# Altium schematic sheet schematic.SchDoc
size A3
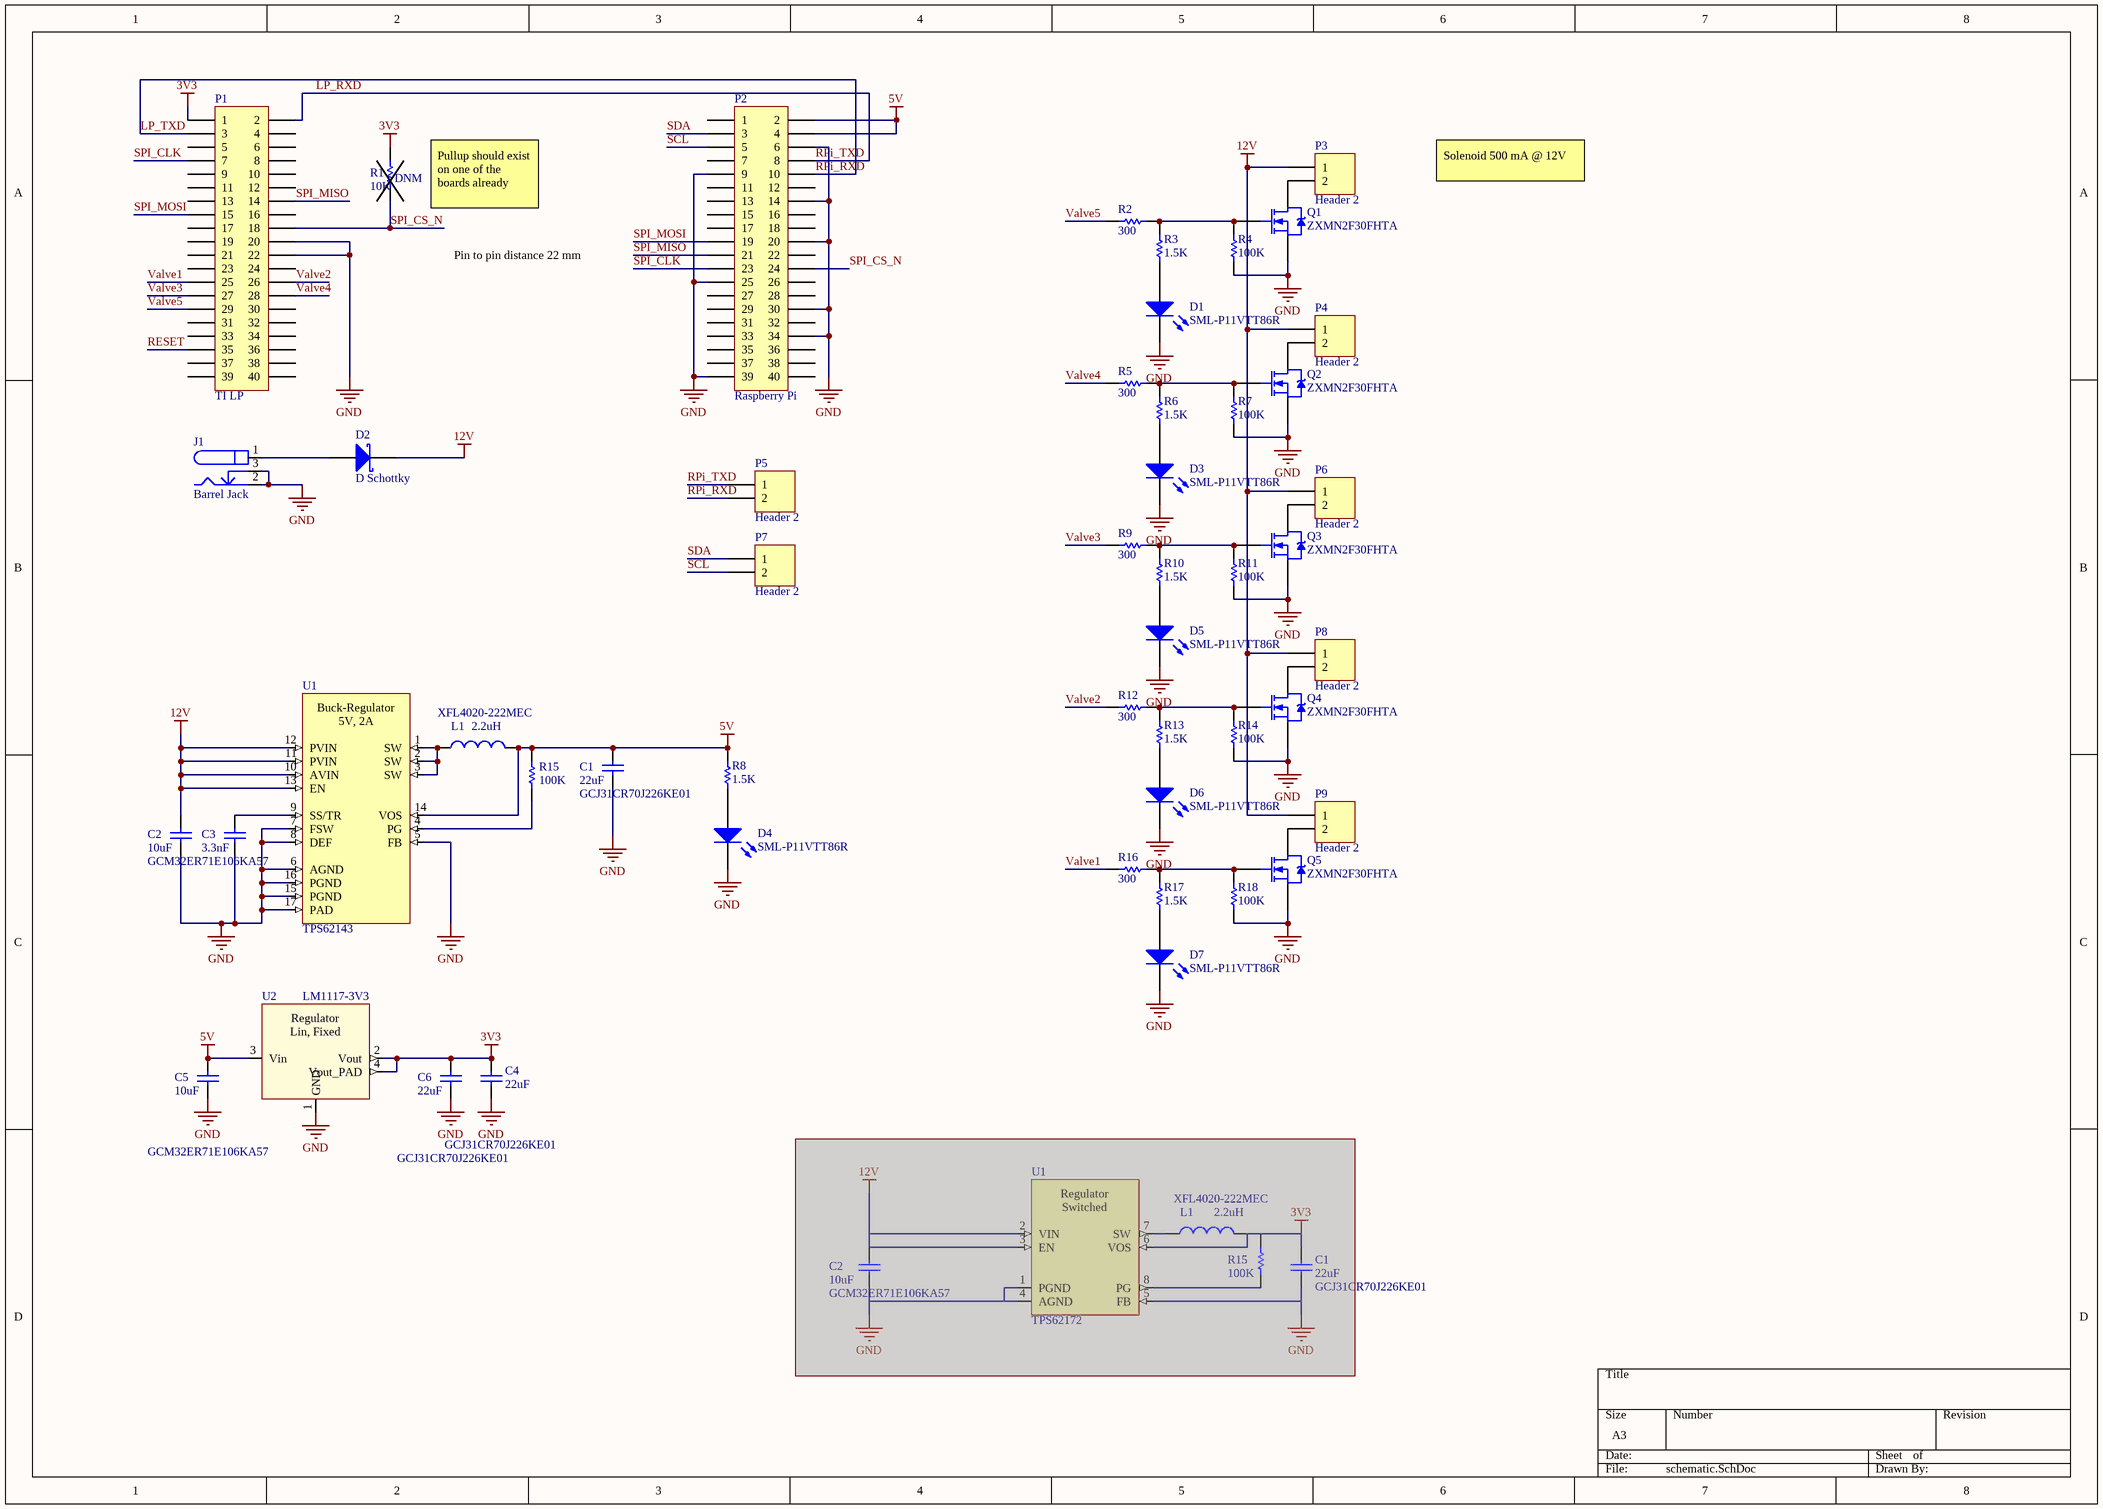
[diagram p0: schematic.SchDoc]

## Parts
(Parts that share a designator on the sheet are numbered #1, #2 ... from top to bottom, then left to right.)
C1#1  GCJ31CR70J226KE01  value 22uF  [1206 (CAP)]
C1#2  GCJ31CR70J226KE01  value 22uF  [1206 (CAP)]  (masked out: inside a compile mask, not in the netlist)
C2#1  GCM32ER71E106KA57  value 10uF  [1210 (CAP)]
C2#2  GCM32ER71E106KA57  value 10uF  [1210 (CAP)]  (masked out: inside a compile mask, not in the netlist)
C3  value 3.3nF  [0603 (CAP)]  (hidden comment: Cap)
C4  GCJ31CR70J226KE01  value 22uF  [1206 (CAP)]
C5  GCM32ER71E106KA57  value 10uF  [1210 (CAP)]
C6  GCJ31CR70J226KE01  value 22uF  [1206 (CAP)]
D1  SML-P11VTT86R  [0402 (RES)]
D2  D Schottky  [SOD123]
D3  SML-P11VTT86R  [0402 (RES)]
D4  SML-P11VTT86R  [0402 (RES)]
D5  SML-P11VTT86R  [0402 (RES)]
D6  SML-P11VTT86R  [0402 (RES)]
D7  SML-P11VTT86R  [0402 (RES)]
J1  Barrel Jack  [PRT-00119]
L1#1  XFL4020-222MEC  value 2.2uH  [XFL4020-222MEC]
L1#2  XFL4020-222MEC  value 2.2uH  [XFL4020-222MEC]  (masked out: inside a compile mask, not in the netlist)
P1  TI LP  [pinheader]
P2  Raspberry Pi  [HDR2X20]
P3  Header 2  [HDR1X2]
P4  Header 2  [HDR1X2]
P5  Header 2  [HDR1X2]
P6  Header 2  [HDR1X2]
P7  Header 2  [HDR1X2]
P8  Header 2  [HDR1X2]
P9  Header 2  [HDR1X2]
Q1  ZXMN2F30FHTA  [SOT23-NMOS]
Q2  ZXMN2F30FHTA  [SOT23-NMOS]
Q3  ZXMN2F30FHTA  [SOT23-NMOS]
Q4  ZXMN2F30FHTA  [SOT23-NMOS]
Q5  ZXMN2F30FHTA  [SOT23-NMOS]
R1  DNM  value 10K  [0402 (RES)]
R2  value 300  [0402 (RES)]  (hidden comment: Res1)
R3  value 1.5K  [0402 (RES)]  (hidden comment: Res1)
R4  value 100K  [0402 (RES)]  (hidden comment: Res1)
R5  value 300  [0402 (RES)]  (hidden comment: Res1)
R6  value 1.5K  [0402 (RES)]  (hidden comment: Res1)
R7  value 100K  [0402 (RES)]  (hidden comment: Res1)
R8  value 1.5K  [0402 (RES)]  (hidden comment: Res1)
R9  value 300  [0402 (RES)]  (hidden comment: Res1)
R10  value 1.5K  [0402 (RES)]  (hidden comment: Res1)
R11  value 100K  [0402 (RES)]  (hidden comment: Res1)
R12  value 300  [0402 (RES)]  (hidden comment: Res1)
R13  value 1.5K  [0402 (RES)]  (hidden comment: Res1)
R14  value 100K  [0402 (RES)]  (hidden comment: Res1)
R15#1  value 100K  [0402 (RES)]  (hidden comment: Res1)
R15#2  value 100K  [0402 (RES)]  (hidden comment: Res1)  (masked out: inside a compile mask, not in the netlist)
R16  value 300  [0402 (RES)]  (hidden comment: Res1)
R17  value 1.5K  [0402 (RES)]  (hidden comment: Res1)
R18  value 100K  [0402 (RES)]  (hidden comment: Res1)
U1#1  TPS62143
U1#2  TPS62172  [WSON-8]  (masked out: inside a compile mask, not in the netlist)
U2  LM1117-3V3  [SOT-223]

## Nets
3V3: C4.1 C6.1 P1.1 R1.2 U2.2(Vout) U2.4(Vout_PAD)
5V: C1#1.1 C5.1 L1#1.2 P2.2 P2.4 R8.1 R15#1.2 U1#1.14(VOS) U2.3(Vin)
12V: C2#1.1 D2.2(K) P3.1 P4.1 P6.1 P8.1 P9.1 U1#1.10(AVIN) U1#1.11(PVIN) U1#1.12(PVIN) U1#1.13(EN)
GND: C1#1.2 C2#1.2 C3.2 C4.2 C5.2 C6.2 D1.2(K) D3.2(K) D4.2(K) D5.2(K) D6.2(K) D7.2(K) J1.2(ON) J1.3(ON) P1.20 P1.22 P2.6 P2.9 P2.14 P2.20 P2.25 P2.30 P2.34 P2.39 Q1.2(S) Q2.2(S) Q3.2(S) Q4.2(S) Q5.2(S) R4.2 R7.2 R11.2 R14.2 R18.2 U1#1.5(FB) U1#1.6(AGND) U1#1.7(FSW) U1#1.8(DEF) U1#1.15(PGND) U1#1.16(PGND) U1#1.17(PAD) U2.1(GND)
LP_RXD: P1.2 P2.8 P5.1  [also labelled RPi_TXD]
LP_TXD: P1.3 P2.10 P5.2  [also labelled RPi_RXD]
RESET: P1.35
SCL: P2.5 P7.2
SDA: P2.3 P7.1
SPI_CLK: P1.7 P2.23
SPI_CS_N: P1.18 P2.24 R1.1
SPI_MISO: P1.14 P2.21
SPI_MOSI: P1.15 P2.19
Valve1: P1.25 R16.2
Valve2: P1.26 R12.2
Valve3: P1.27 R9.2
Valve4: P1.28 R5.2
Valve5: P1.29 R2.2
NetC3_1: C3.1 U1#1.9(SS/TR)
NetD1_1: D1.1(A) R3.2
NetD2_1: D2.1(A) J1.1(ON)
NetD3_1: D3.1(A) R6.2
NetD4_1: D4.1(A) R8.2
NetD5_1: D5.1(A) R10.2
NetD6_1: D6.1(A) R13.2
NetD7_1: D7.1(A) R17.2
NetL1#1_1: L1#1.1 U1#1.1(SW) U1#1.2(SW) U1#1.3(SW)
NetP3_2: P3.2 Q1.3(D)
NetP4_2: P4.2 Q2.3(D)
NetP6_2: P6.2 Q3.3(D)
NetP8_2: P8.2 Q4.3(D)
NetP9_2: P9.2 Q5.3(D)
NetQ1_1: Q1.1(G) R2.1 R3.1 R4.1
NetQ2_1: Q2.1(G) R5.1 R6.1 R7.1
NetQ3_1: Q3.1(G) R9.1 R10.1 R11.1
NetQ4_1: Q4.1(G) R12.1 R13.1 R14.1
NetQ5_1: Q5.1(G) R16.1 R17.1 R18.1
NetR15#1_1: R15#1.1 U1#1.4(PG)

Not connected (* = marked no-connect by the designer): P1 4 5 6 8 9 10 11 12 13 16 17 19 21 23 24 30 31 32 33 34 36 37 38 39 40; P2 1 7 11 12 13 15 16 17 18 22 26 27 28 29 31 32 33 35 36 37 38 40

## Notes on the sheet
- Solenoid 500 mA @ 12V
- (near R1) Pullup should exist on one of the boards already
- Pin to pin distance 22 mm
- (in symbol LM1117-FIXED) Regulator; Lin, Fixed
- (in symbol TPS62143) Buck-Regulator; 5V, 2A
- (in symbol TPS62172) Regulator; Switched

## Library data of the parts
C1#1 C1#2 C4 C6 = Cap: 1206; Published: 8-Jun-2000; LatestRevisionDate: 17-Jul-2002; LatestRevisionNote: Re-released for DXP Platform.; PackageReference: RAD-0.3; Publisher: Altium Limited; PackageDescription: Radial Cap, Thru-Hole; 2 Leads; 0.3 in Pin Spacing
  C1#1 C4 C6: Part Number: GCJ31CR70J226KE01
C2#1 C2#2 C5 = Cap: 1210; Published: 8-Jun-2000; LatestRevisionDate: 17-Jul-2002; LatestRevisionNote: Re-released for DXP Platform.; PackageReference: RAD-0.3; Publisher: Altium Limited; PackageDescription: Radial Cap, Thru-Hole; 2 Leads; 0.3 in Pin Spacing
  C2#1 C5: Part Number: GCM32ER71E106KA57
C3 = Cap: 0603; Part Number: GRM033R71E332KA12D; Published: 8-Jun-2000; LatestRevisionDate: 17-Jul-2002; LatestRevisionNote: Re-released for DXP Platform.; PackageReference: RAD-0.3; Publisher: Altium Limited; PackageDescription: Radial Cap, Thru-Hole; 2 Leads; 0.3 in Pin Spacing
D1 D3-D7 = LED2: Typical RED, GREEN, YELLOW, AMBER GaAs LED; Published: 8-Jun-2000; LatestRevisionDate: 17-Jul-2002; LatestRevisionNote: Re-released for DXP Platform.; PackageVersion: Feb-2002; PackageReference: 3.2X1.6X1.1; Publisher: Altium Limited; PackageDescription: SM LED; 2 Flat Leads; Part Number: SML-P11VTT86R
D2 = D Schottky: Schottky Diode; Part Number: B140HW-7; Published: 8-Jun-2000; LatestRevisionDate: 17-Jul-2002; LatestRevisionNote: Re-released for DXP Platform.; PackageReference: SMB; Publisher: Altium Limited; PackageDescription: DO-214-AA/SMB; 2 C-Bend Leads; Body 5.3 x 3.6 mm, inc. leads (LxW); Code_JEDEC: DO-214-AA
J1 = DC Barrel: Part Number: PRT-00119
L1#1 L1#2 = Inductor: Code_IEC: 1005; Published: 8-Jun-2000; LatestRevisionDate: 29-May-2009; LatestRevisionNote: IPC-7351 Footprint Added.; PackageReference: 0402-A; Publisher: Altium Limited; PackageDescription: Chip Inductor; Code_JEITA: 0402
  L1#1: Part Number: XFL4020-222MEC
P1 = Header 20X2: Header, 20-Pin, Dual row; Part Number: 929975-01-10-RK; LatestRevisionDate: 17-Jul-2002; LatestRevisionNote: Re-released for DXP Platform.; Publisher: Altium Limited
P2 = Header 20X2: Header, 20-Pin, Dual row; Part Number: 929975-01-20-RK; LatestRevisionDate: 17-Jul-2002; LatestRevisionNote: Re-released for DXP Platform.; Publisher: Altium Limited
P3 = Header 2: Header, 2-Pin; Part Number: 10129378-920001BLF; LatestRevisionDate: 17-Jul-2002; LatestRevisionNote: Re-released for DXP Platform.; Publisher: Altium Limited
P4-P9 = Header 2: Header, 2-Pin; LatestRevisionDate: 17-Jul-2002; LatestRevisionNote: Re-released for DXP Platform.; Publisher: Altium Limited
Q1-Q5 = NMOS-2: N-Channel Power MOSFET; Note: Pin 2 is electrically connected to pin 4.; Published: 8-Jun-2000; LatestRevisionDate: 17-Jul-2002; LatestRevisionNote: Re-released for DXP Platform.; DatasheetVersion: PD-9.814; PackageVersion: Feb-1997; PackageReference: TO-220AB; Publisher: Altium Limited; PackageDescription: TO, Thru-Hole, Vertical, Heatsink Mounted; 3 In-Line Leads; Pitch 2.54 mm; ComponentLink1Description: Manufacturer Link; ComponentLink1URL: http://www.irf.com/; Part Number: ZXMN2F30FHTA
R1 = Res1: Resistor; Part Number: AC0402FR-1310KL; Published: 8-Jun-2000; LatestRevisionDate: 17-Jul-2002; LatestRevisionNote: Re-released for DXP Platform.; PackageReference: AXIAL-0.3; Publisher: Altium Limited; PackageDescription: Axial Device, Thru-Hole; 2 Leads; 0.3 in Pin Spacing
R2 R5 R9 R12 R16 = Res1: Resistor; Part Number: ERJ-2RKF2800X; Published: 8-Jun-2000; LatestRevisionDate: 17-Jul-2002; LatestRevisionNote: Re-released for DXP Platform.; PackageReference: AXIAL-0.3; Publisher: Altium Limited; PackageDescription: Axial Device, Thru-Hole; 2 Leads; 0.3 in Pin Spacing
R3 R6 R8 R10 R13 R17 = Res1: Resistor; Part Number: RC0402FR-071K5L; Published: 8-Jun-2000; LatestRevisionDate: 17-Jul-2002; LatestRevisionNote: Re-released for DXP Platform.; PackageReference: AXIAL-0.3; Publisher: Altium Limited; PackageDescription: Axial Device, Thru-Hole; 2 Leads; 0.3 in Pin Spacing
R4 R7 R11 R14 R15#1 R18 = Res1: Resistor; Part Number: ERJ-2RKF1003X; Published: 8-Jun-2000; LatestRevisionDate: 17-Jul-2002; LatestRevisionNote: Re-released for DXP Platform.; PackageReference: AXIAL-0.3; Publisher: Altium Limited; PackageDescription: Axial Device, Thru-Hole; 2 Leads; 0.3 in Pin Spacing
R15#2 = Res1: Resistor; Published: 8-Jun-2000; LatestRevisionDate: 17-Jul-2002; LatestRevisionNote: Re-released for DXP Platform.; PackageReference: AXIAL-0.3; Publisher: Altium Limited; PackageDescription: Axial Device, Thru-Hole; 2 Leads; 0.3 in Pin Spacing
U1#1 = TPS62143: 5V, 2A Switched Buck Regulator; Part Number: TPS62143RGT
U2 = LM1117-FIXED: Linear Voltage Regulator 800 mA 1.2V Dropout; Part Number: LM1117MPX-3.3/NOPB